# EAGLE design ftdi (EAGLE 6.5.0)
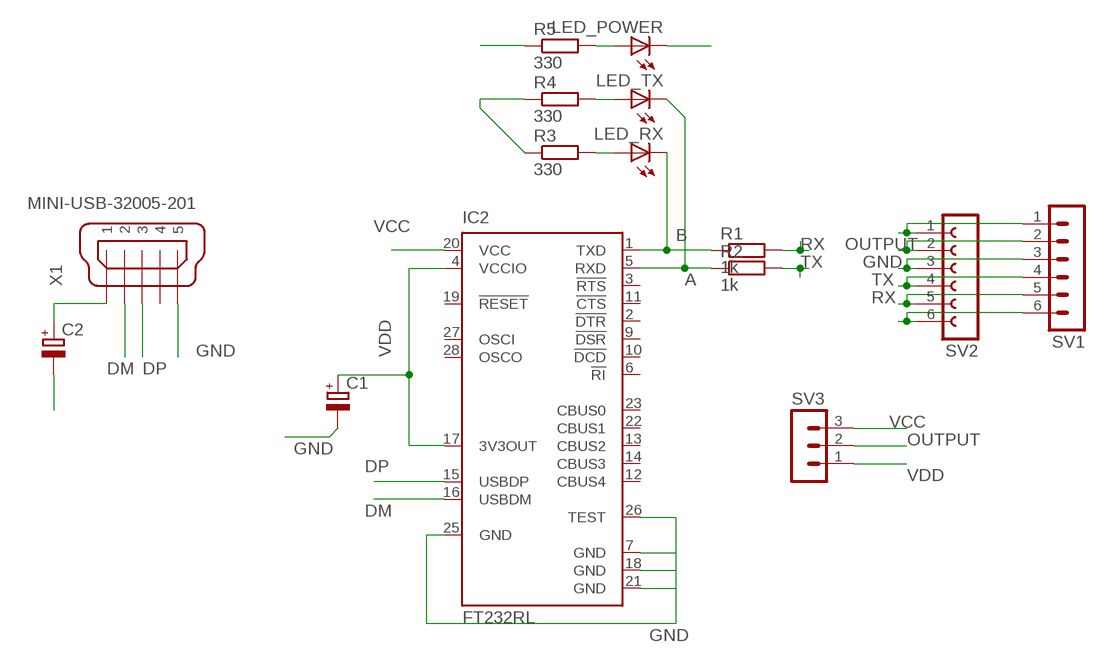
[diagram p0: schematic, sheet 1]

## Parts
C1  CPOL-EUE2.5-5  [E2,5-5]
C2  CPOL-EUE2.5-5  [E2,5-5]
IC2  FT232RL  [SSOP28]
LED_POWER  LED3MM  [LED3MM]
LED_RX  LED3MM  [LED3MM]
LED_TX  LED3MM  [LED3MM]
R1  1k  R-EU_0204/7  [0204/7]
R2  1k  R-EU_0204/7  [0204/7]
R3  330  R-EU_0204/7  [0204/7]
R4  330  R-EU_0204/7  [0204/7]
R5  330  R-EU_0204/7  [0204/7]
SV1  MA06-1  [MA06-1]
SV2  FE06-1  [FE06]
SV3  MA03-1  [MA03-1]
X1  MINI-USB-32005-201  [32005-201]

## Nets
A: IC2.5(RXD) LED_TX.K(C) R2.1
B: IC2.1(TXD) LED_RX.K(C) R1.1
DM: IC2.16(USBDM) X1.2
DP: IC2.15(USBDP) X1.3
GND: C1.- C2.- IC2.7(GND) IC2.18(GND) IC2.21(GND) IC2.25(GND) IC2.26(TEST) LED_POWER.K(C) SV1.3 SV2.3 X1.5
N$1: LED_POWER.A R5.2
N$2: LED_TX.A R4.2
N$3: SV1.1 SV2.1
N$4: LED_RX.A R3.2
N$9: SV1.6 SV2.6
OUTPUT: SV1.2 SV2.2 SV3.2
RX: R1.2 SV1.5 SV2.5
TX: R2.2 SV1.4 SV2.4
VCC: C2.+ IC2.20(VCC) R5.1 SV3.3 X1.1
VDD: C1.+ IC2.4(VCCIO) IC2.17(3V3OUT) R3.1 R4.1 SV3.1
Unconnected: IC2.2(!DTR) IC2.3(!RTS) IC2.6(!RI) IC2.9(!DSR) IC2.10(!DCD) IC2.11(!CTS) IC2.12(CBUS4) IC2.13(CBUS2) IC2.14(CBUS3) IC2.19(!RESET) IC2.22(CBUS1) IC2.23(CBUS0) IC2.27(OSCI) IC2.28(OSCO) X1.4

## Library data of the parts
C1 C2 = rcl:CPOL-EU: POLARIZED CAPACITOR, European symbol
IC2 = ftdichip:FT232R: Source: http://www.ftdichip.com/Documents/DataSheets/DS_FT232R_v104.pdf; MPN: FT232RL; OC_FARNELL: 1146032; OC_NEWARK: 91K9918
LED_POWER LED_RX LED_TX = led:LED: LED OSRAM: - CHIPLED LG R971, LG N971, LY N971, LG Q971, LY Q971, LO R971, LY R971 LH N974, LH R974 LS Q976, LO Q976, LY Q976 LO Q996 - Hyper CHIPLED LW Q18S LB Q993, LB Q99A, LB R99A - SideLED LS A670, LO A670, LY A670, LG A670, LP A670 LB A673, LV A673, LT A673, LW A673 LH A674 LY A675 LS A676, LA A676, LO A676, LY A676, LW A676 LS A679, LY A679, LG A679 - Hyper Micro SIDELED® LS Y876, LA Y876, LO Y876, LY Y876 LT Y87S - SmartLED LW L88C, LW L88S LB L89C, LB L89S, LG L890 LS L89K, LO L89K, LY L89K LS L896, LA L896, LO L896, LY L896 - TOPLED LS T670, LO T670, LY T670, LG T670, LP T670 LSG T670, LSP T670, LSY T670, LOP T670, LYG T670 LG T671, LOG T671, LSG T671 LB T673, LV T673, LT T673, LW T673 LH T674 LS T676, LA T676, LO T676, LY T676, LB T676, LH T676, LSB T676, LW T676 LB T67C, LV T67C, LT T67C, LS T67K, LO T67K, LY T67K, LW E67C LS E67B, LA E67B, LO E67B, LY E67B, LB E67C, LV E67C, LT E67C LW T67C LS T679, LY T679, LG T679 LS T770, LO T770, LY T770, LG T770, LP T770 LB T773, LV T773, LT T773, LW T773 LH T774 LS E675, LA E675, LY E675, LS T675 LS T776, LA T776, LO T776, LY T776, LB T776 LHGB T686 LT T68C, LB T68C - Hyper Mini TOPLED® LB M676 - Mini TOPLED Santana® LG M470 LS M47K, LO M47K, LY M47K Source: http://www.osram.convergy.de LUXEON: - LUMILED® LXK2-PW12-R00, LXK2-PW12-S00, LXK2-PW14-U00, LXK2-PW14-V00 LXK2-PM12-R00, LXK2-PM12-S00, LXK2-PM14-U00 LXK2-PE12-Q00, LXK2-PE12-R00, LXK2-PE12-S00, LXK2-PE14-T00, LXK2-PE14-U00 LXK2-PB12-K00, LXK2-PB12-L00, LXK2-PB12-M00, LXK2-PB14-N00, LXK2-PB14-P00, LXK2-PB14-Q00 LXK2-PR12-L00, LXK2-PR12-M00, LXK2-PR14-Q00, LXK2-PR14-R00 LXK2-PD12-Q00, LXK2-PD12-R00, LXK2-PD12-S00 LXK2-PH12-R00, LXK2-PH12-S00 LXK2-PL12-P00, LXK2-PL12-Q00, LXK2-PL12-R00 Source: www.luxeon.com KINGBRIGHT: KA-3528ASYC Source: www.kingbright.com
R1-R5 = resistor:R-EU_: RESISTOR, European symbol
SV1 = con-lstb:MA06-1: PIN HEADER; OC_FARNELL: unknown; OC_NEWARK: unknown
SV2 = con-lsta:FE06-1: FEMALE HEADER; OC_FARNELL: unknown; OC_NEWARK: unknown
SV3 = con-lstb:MA03-1: PIN HEADER; OC_FARNELL: unknown; OC_NEWARK: unknown
X1 = con-cypressindustries:MINI-USB-: MINI USB-B Conector Source: www.cypressindustries.com; OC_FARNELL: unknown; OC_NEWARK: unknown

## Board
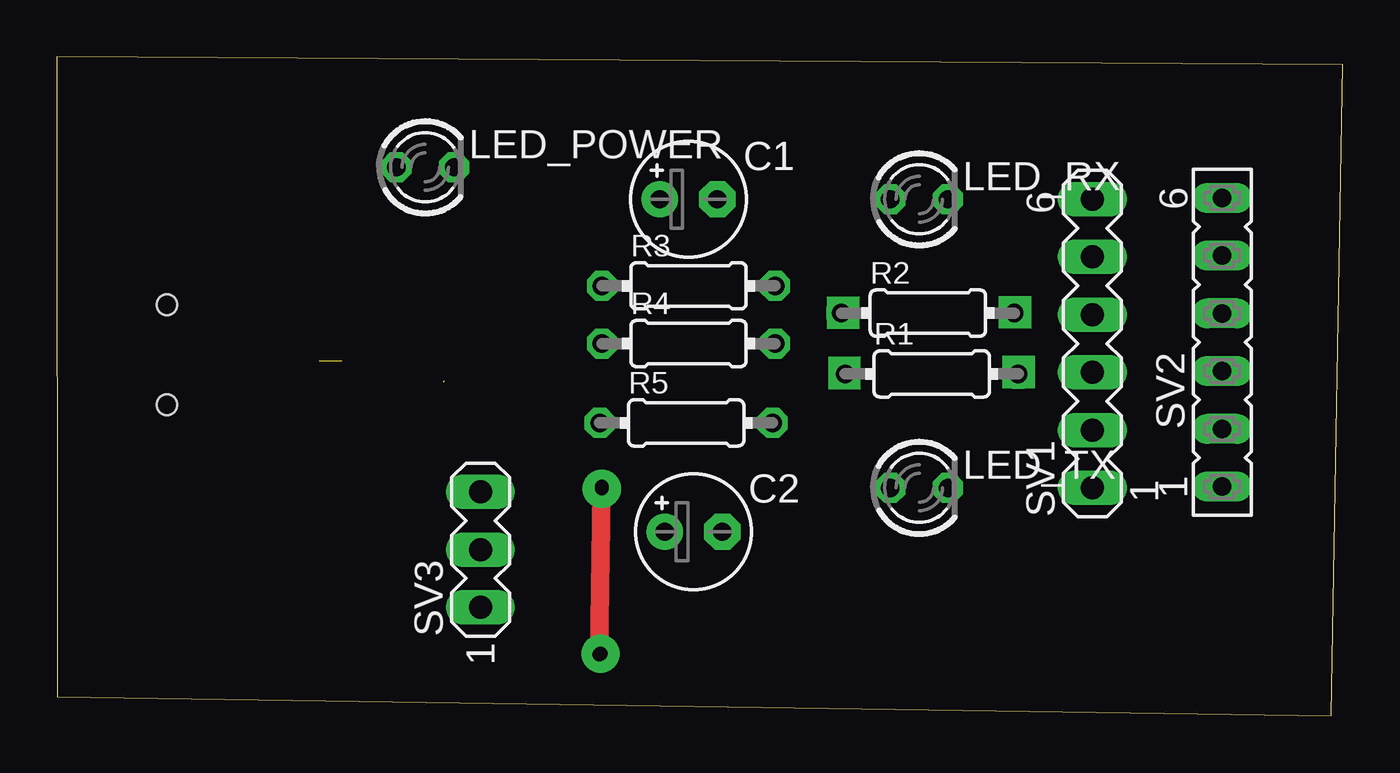
[diagram p1: board, top side]
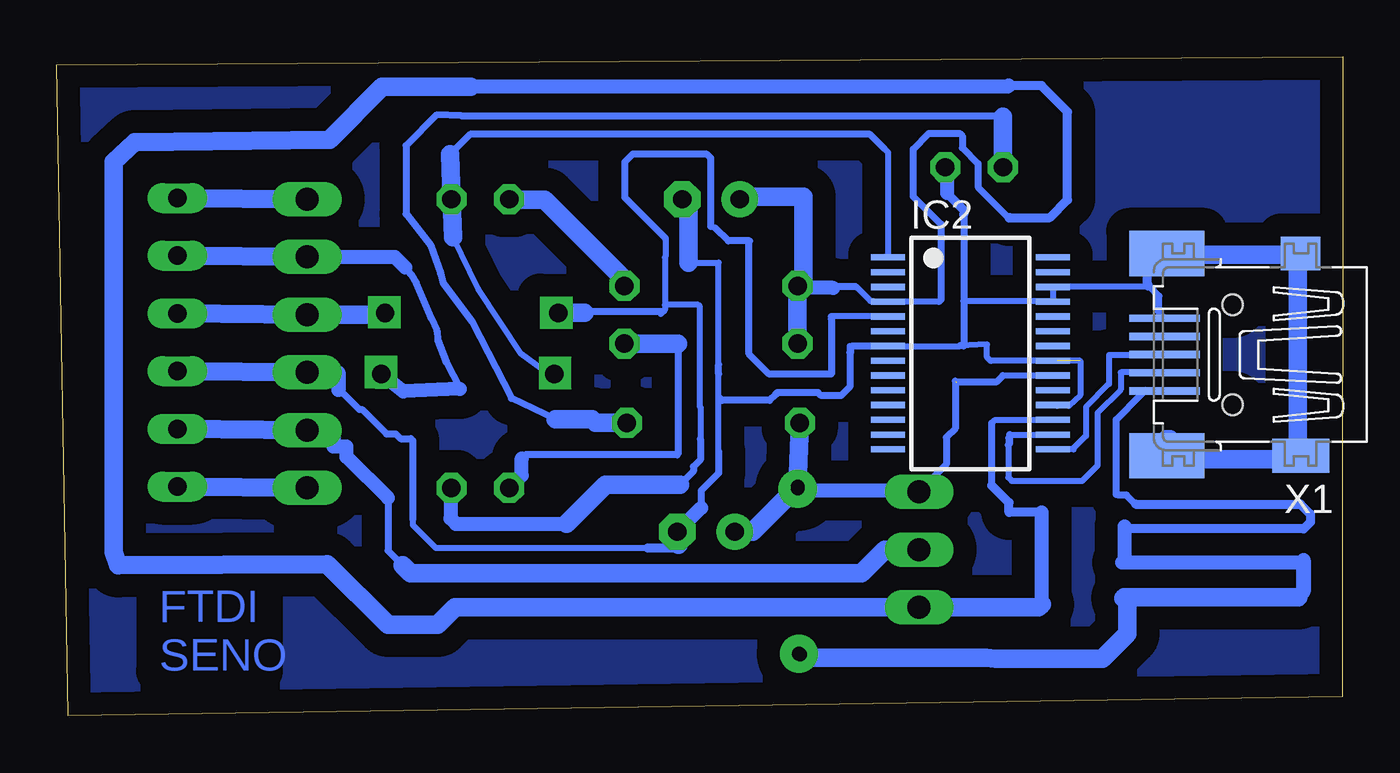
[diagram p2: board, bottom side, seen from below]

Size 56.62 x 29.01 mm. Coordinates in mm from the lower left corner, seen from the top.
Outline: 0.03,0.85 56.12,0 56.62,28.66 0,29.01 0.03,0.85
Copper layers (1*16): Top 0.035mm / dielectric 1.5mm / Bottom 0.035mm
Design rules "default": minimum track width 10mil, minimum drill 24mil, track to track 8mil, track to pad 8mil, pad to pad 8mil, via to via 8mil, smd to smd 8mil, copper to edge 40mil, drill to drill 8mil, minimum pad ring 10mil, minimum via ring 8mil, stop-mask expansion 4mil, vias tented up to drill 0mil, thermal gap 10mil

### Footprints (pad centres in the part's own frame; a part is rotated, then mirrored left to right if it is on the bottom)
E2,5-5 = drill 0.813 pad 1.6: + -1.27,0 | drill 0.813 pad 1.6 octagon: - 1.27,0
SSOP28 = smd 0.273 x 1.5: 1 -4.225,-3.625; 2 -3.575,-3.625; 3 -2.925,-3.625; 4 -2.275,-3.625; 5 -1.625,-3.625; 6 -0.975,-3.625; 7 -0.325,-3.625; 8 0.325,-3.625; 9 0.975,-3.625; 10 1.625,-3.625; 11 2.275,-3.625; 12 2.925,-3.625; 13 3.575,-3.625; 14 4.225,-3.625; 15 4.225,3.625; 16 3.575,3.625; 17 2.925,3.625; 18 2.275,3.625; 19 1.625,3.625; 20 0.975,3.625; 21 0.325,3.625; 22 -0.325,3.625; 23 -0.975,3.625; 24 -1.625,3.625; 25 -2.275,3.625; 26 -2.925,3.625; 27 -3.575,3.625; 28 -4.225,3.625
LED3MM = drill 0.813 octagon: A -1.27,0; K 1.27,0
0204/7 = drill 0.813 octagon: 1 -3.81,0; 2 3.81,0
MA06-1 = drill 1.016 long: 1 -6.35,0; 2 -3.81,0; 3 -1.27,0; 4 1.27,0; 5 3.81,0; 6 6.35,0
FE06 = drill 0.813 long: 1 -6.35,0; 2 -3.81,0; 3 -1.27,0; 4 1.27,0; 5 3.81,0; 6 6.35,0
MA03-1 = drill 1.016 long: 1 -2.54,0; 2 0,0; 3 2.54,0
32005-201 = smd 3.1 x 0.322: 1 3,1.6; 2 3,0.8; 3 3,0; 4 3,-0.8; 5 3,-1.6 | smd 1.738 x 1.492: M1 -3,-4.45 | smd 2.5 x 1.492: M2 -3,4.45 | smd 3.3 x 2: M3 2.9,4.45; M4 2.9,-4.45 | hole 0.9: 0,2.2; 0,-2.2

### Placement (x,y rotation side)
C1  27.81,22.74 0 top
C2  28.04,8.1 0 top
IC2  16.39,15.95 270 bottom
LED_POWER  16.23,24.15 0 top
LED_RX  37.97,22.74 0 top
LED_TX  37.97,10.04 0 top
R1  38.52,15.05 0 top
R2  38.35,17.73 0 top
R3  27.81,18.93 0 top
R4  27.81,16.39 0 top
R5  27.71,12.89 0 top
SV1  45.59,16.39 90 top
SV2  51.31,16.44 90 top
SV3  18.66,7.32 90 top
X1  4.85,15.9 180 bottom

### Tracks (layer width: path | path; a pad name or v marks a point on that pad's centre or on a via)
A
  Bottom 0.254: IC2.5 20.25,17.58 22.52,17.58 | 29.84,18.09 28.37,18.09 28.3,18.02 28.3,13.62 28.29,13.6 28.29,12.18 | 30.42,21.61 29.82,21.01 29.82,20.2 29.84,20.18 29.84,18.09 | 29.84,18.09 29.84,17.87 29.9,17.81 30.03,17.68 | 34.49,17.68 R2.1 | 27.62,21.47 27.82,21.53
  Bottom 0.305: 33.37,17.74 33.3,17.81 29.9,17.81 | 22.52,17.58 22.52,17.46 22.52,15.04 25.25,15.04 26.14,15.93 26.14,20.88 26.11,20.91 27.05,20.91 27.62,21.47 | 28.29,12.18 28.29,11.27 28.59,10.97 28.59,10.76 29.18,10.17 | 29.82,21.01 29.82,21.03 31.61,22.81 31.61,24.38 31.25,24.74 28.01,24.74 27.83,24.56 27.83,21.55 27.82,21.53
  Bottom 0.61: LED_TX.K 39.28,10 39.28,8.69 39.04,8.45 34.17,8.45 | 34.49,17.68 34.43,17.74
  Bottom 0.813: 29.18,10.17 32.46,10.17 34.17,8.45 | 33.37,17.74 R2.1
B
  Bottom 0.254: 20.19,20.2 IC2.1 20.02,24.8 20.19,24.98 | R1.1 34.93,15.12 34.95,15.03 36.17,15.93 38.07,18.79 39.16,21.07
  Bottom 0.305: 20.19,24.98 20.81,25.59 38.42,25.59 39.3,24.71 | 39.3,22.79 LED_RX.K
  Bottom 0.813: 39.3,24.71 LED_RX.K 39.16,21.07
DM
  Bottom 0.254: X1.2 8,15.12 9.78,15.12 9.78,14.36 10.8,13.34 10.8,11.02 11.47,10.34 14.58,10.34 14.73,10.5 14.73,11.93 14.73,12.24 | 14.67,12.38 IC2.16
  Bottom 0.305: 14.67,12.38 14.67,11.98 14.73,11.93
DP
  Bottom 0.254: X1.3 8,15.88 10.29,15.88 10.29,14.61 11.3,13.59 11.3,12.32 11.85,11.78 11.85,11.73 IC2.15
GND  (1 unrouted)
  Bottom 0.254: IC2.18 12.15,13.7 12.57,13.64 12.06,13.64 11.56,14.1 11.56,15.63 15.47,15.63 15.49,15.61 15.66,15.78 15.66,16.35 16.85,16.29 16.86,16.28 21.64,16.28 | 12.57,15.63 IC2.21 12.83,15.63 | IC2.7 20.09,16.28 21.64,16.28 | 29.08,19.94 28.8,19.94 27.48,19.94 27.48,15.46 27.48,14.04 27.48,11.64 | 29.85,7.38 30.59,7.38 39.92,7.38 40.94,8.39 40.94,8.64 | 8.5,18.88 IC2.26 IC2.25 12.79,18.25 16.69,18.25 | 21.7,16 21.64,16 21.64,16.28 | 21.64,16.28 21.71,16.28 21.71,15.97
  Bottom 0.305: 16.69,22.07 16.69,18.25 16.69,16.27 16.85,16.29 | 44.65,15.12 SV1.3 | 40.94,8.64 40.94,10.58 40.94,10.59 40.94,12.11 41.03,12.2 41.48,12.2 41.7,12.42 42.1,12.42 43.18,13.49 43.31,13.49 44.15,14.34 44.21,14.34 | 8.5,18.88 8.09,18.47 8.09,17.75 X1.5 | 27.48,15.05 27.48,15.46 | 21.7,16 21.7,14.48 22.09,14.09 22.97,14.09 23.1,14.22 24.9,14.22 24.98,14.14 | 24.98,14.14 | 24.98,14.14 25.24,13.89 27.32,13.89 27.48,14.04 | 27.48,11.64 27.48,10.69 28.25,9.91 28.25,9.16
  Bottom 0.406: 29.24,7.54 29.4,7.38 30.59,7.38 | LED_POWER.K 17.42,24.08 | 17.42,23 16.69,22.26 16.69,22.07
  Bottom 0.61: 44.65,15.12 44.21,15.12 44.21,14.34 | C2.- 28.25,9.16 | 17.42,24.08 17.42,23
  Bottom 0.813: SV1.3 SV2.3 | C1.- 28.8,22.46 28.8,19.94 | C2.- 29.31,7.6 29.24,7.54
N$1
  Bottom 0.305: 14.96,26.37 15.01,26.42 38.82,26.42 39.89,26.45 41.24,25.1 41.24,22.09 40.16,20.72 39.72,19.48 39.6,19.03 38.33,17.34 36.6,13.98 34.67,13.05 | 32.9,12.89 33.05,13.05
  Bottom 0.813: 33.05,13.05 34.67,13.05 | LED_POWER.A 14.96,26.37 | 32.9,12.89 R5.2
N$2
  Bottom 0.305: 29.27,16.39 29.27,11.52 29.31,11.49 36,11.49 36.15,11.33
  Bottom 0.61: LED_TX.A 36.15,10.59 36.15,11.33
  Bottom 0.813: 29.27,16.39 R4.2
N$3
  Bottom 0.813: SV1.1 SV2.1
N$4
  Bottom 0.813: LED_RX.A 36.67,22.71 35.13,22.71 31.62,19.2 R3.2
N$5
  pour Bottom: 0.35,0.83 0.35,1.04 -0.01,1.04
N$6
  pour Bottom (isolate 1.016): 0.34,28.78 56.19,28.27 56.27,0.97 0.21,0.54 0.21,28.78
N$7  (via drill 0.6 pad 1.68)
  other vias: 24,10
N$8  (via drill 0.6 pad 1.68)
  other vias: 23.94,2.73
N$9
  Bottom 0.813: SV1.6 SV2.6
N$10  (via drill 0.6 pad 1.42)
  other vias: 34.68,15.1
N$11  (via drill 0.6 pad 1.42)
  other vias: 42.35,15.13
N$12  (via drill 0.6 pad 1.42)
  other vias: 42.19,17.76
N$13  (via drill 0.6 pad 1.42)
  other vias: 34.62,17.75
N$14
  Bottom 0.406: 8.61,20.29 8.61,18.97 8.57,18.97 8.57,18.93 | 2.26,20.29 2.26,20.44 1.98,20.44 | 8.19,11.72 8.19,11.62 7.76,11.62 7.76,12.18
  Bottom 0.813: 8.61,20.29 1.98,20.29 | 1.98,20.29 1.98,20.44 | 7.76,12.18 7.62,12.18 7.62,11.3 1.56,11.3 1.56,11.34 1.98,11.34 1.98,20.29
OUTPUT
  Bottom 0.305: SV1.2 45.03,12.58 | 42.04,9.59 42.04,7.28 41.39,6.62
  Bottom 0.61: 45.03,12.58 44.43,12.58 44.43,11.86 43.87,11.86 43.87,11.39 43.84,11.39 42.04,9.59
  Bottom 0.813: SV1.2 SV2.2 | 41.39,6.62 41.04,6.28 21.2,6.28 20.16,7.32 SV3.2
RX
  Bottom 0.254: 42.29,15.12 R1.2
  Bottom 0.305: 41.26,19.73 41.03,19.43 40.79,19.07 40.4,18.14 40.14,17.51 39.88,16.94 39.84,16.55 39.49,15.58 38.86,14.39
  Bottom 0.61: 38.86,14.39 41.37,14.28 R1.2 | SV1.5 41.73,20.2 41.26,19.73
  Bottom 0.813: SV1.5 SV2.5
TX
  Bottom 0.254: 42.29,17.66 R2.2
  Bottom 0.813: SV2.4 SV1.4 42.29,17.66
VCC  (via drill 0.6)  (1 unrouted)
  Top 0.813: v23.88,2.7 23.98,9.89 v24,10.09
  Bottom 0: 9.99,13.05 9.99,9.75 9.99,9.69 | 9.89,9.72 9.84,9.72 9.53,9.72 9.49,9.67 9.49,9.58 9.2,9.29 2.14,9.29 2.09,9.24 1.9,9.24 1.54,8.89 1.54,8.34 1.68,8.2 9.39,8.2 9.58,8.01 9.58,6.75 9.7,6.63 2.14,6.63 2.04,6.72 2.04,5.32 2.14,5.22 9.32,5.22 9.49,5.06
  Bottom 0.254: 12.91,14.96 IC2.20 14.97,14.98
  Bottom 0.305: 19.11,9.41 SV3.3 17.45,11.06 17.45,12.26 17.06,12.65 17.06,14.74 | X1.1 8.69,14.33 8.93,14.09 9.96,13.03 9.99,13.05 9.99,9.78 | 9.12,9.32 9.52,9.72 9.84,9.72 | 9.89,9.72 9.92,9.75 9.99,9.75 | C2.+ 25.99,8.1 | 14.97,14.98 15.26,14.69 17.01,14.69
  Bottom 0.406: 9.12,9.32 1.86,9.32 1.42,8.87 1.42,8.53 1.72,8.23 9.51,8.23 9.61,8.33
  Bottom 0.61: 9.61,8.33 9.61,6.85 9.71,6.75 1.82,6.75 1.72,6.85 1.72,5.47 1.96,5.22 | 23.85,9.93 18.73,9.93 SV3.3
  Bottom 0.813: 1.96,5.22 9.61,5.22 9.66,5.17 | v24,10.09 23.85,9.93 23.97,9.93 24,9.97 v24,10.09 | 18.89,9.62 SV3.3 | 9.49,5.06 9.49,3.62 10.59,2.51 15.28,2.51 15.71,2.55 23.98,2.55 v23.88,2.7 | R5.1 v24,10.09 | 25.99,8.1 v24,10.09
VDD
  Bottom 0.254: 17.78,18.23 | 17.78,18.23 IC2.4 20.65,18.23 20.68,18.26 20.8,18.26 21.42,18.88 | 15.45,12.89 15.31,13.03 IC2.17
  Bottom 0.305: 17.78,18.23 17.68,18.33 17.68,21.66 17.71,21.66 18.91,22.86 18.91,24.95 18.23,25.63 16.86,25.63 16.75,25.53 16.75,25 16.06,24.3 16.06,23.27 14.7,21.91 | 18.26,4.38 SV3.1 | 15.45,10.14 15.45,12.89 | 21.42,18.88 22.39,18.88 22.44,18.84
  Bottom 0.406: 14.7,21.91 14.67,21.93 12.89,21.93 12.11,22.72 12.11,26.58 13.26,27.74 14.7,27.74 | 13.25,8.95 14.7,8.95 14.7,9.38 15.45,10.14
  Bottom 0.61: 14.7,27.74 14.74,27.7 38.39,27.7 | 13.25,4.92 13.25,8.95 | 22.44,18.84 23.91,18.84 R3.1
  Bottom 0.813: 38.39,27.7 38.4,27.69 42.29,27.69 44.61,25.37 53.18,25.24 54.12,24.38 54.12,7.21 53.91,6.62 44.7,6.68 42.04,4.02 39.85,4.02 39.08,4.79 21.13,4.79 21.12,4.78 SV3.1 13.39,4.78 13.25,4.92 | C1.+ 26.44,22.84 23.75,22.84 23.75,18.93 R3.1 R4.1

### Text on the board
Bottom: FTDI / SENO